# Altium schematic sheet MB1-Hed-r1.0.SchDoc: Headers
size A; DrawnBy: MBoard Team; DocumentNumber: 5; Revision: 1.1; SheetNumber: 5; SheetTotal: 7
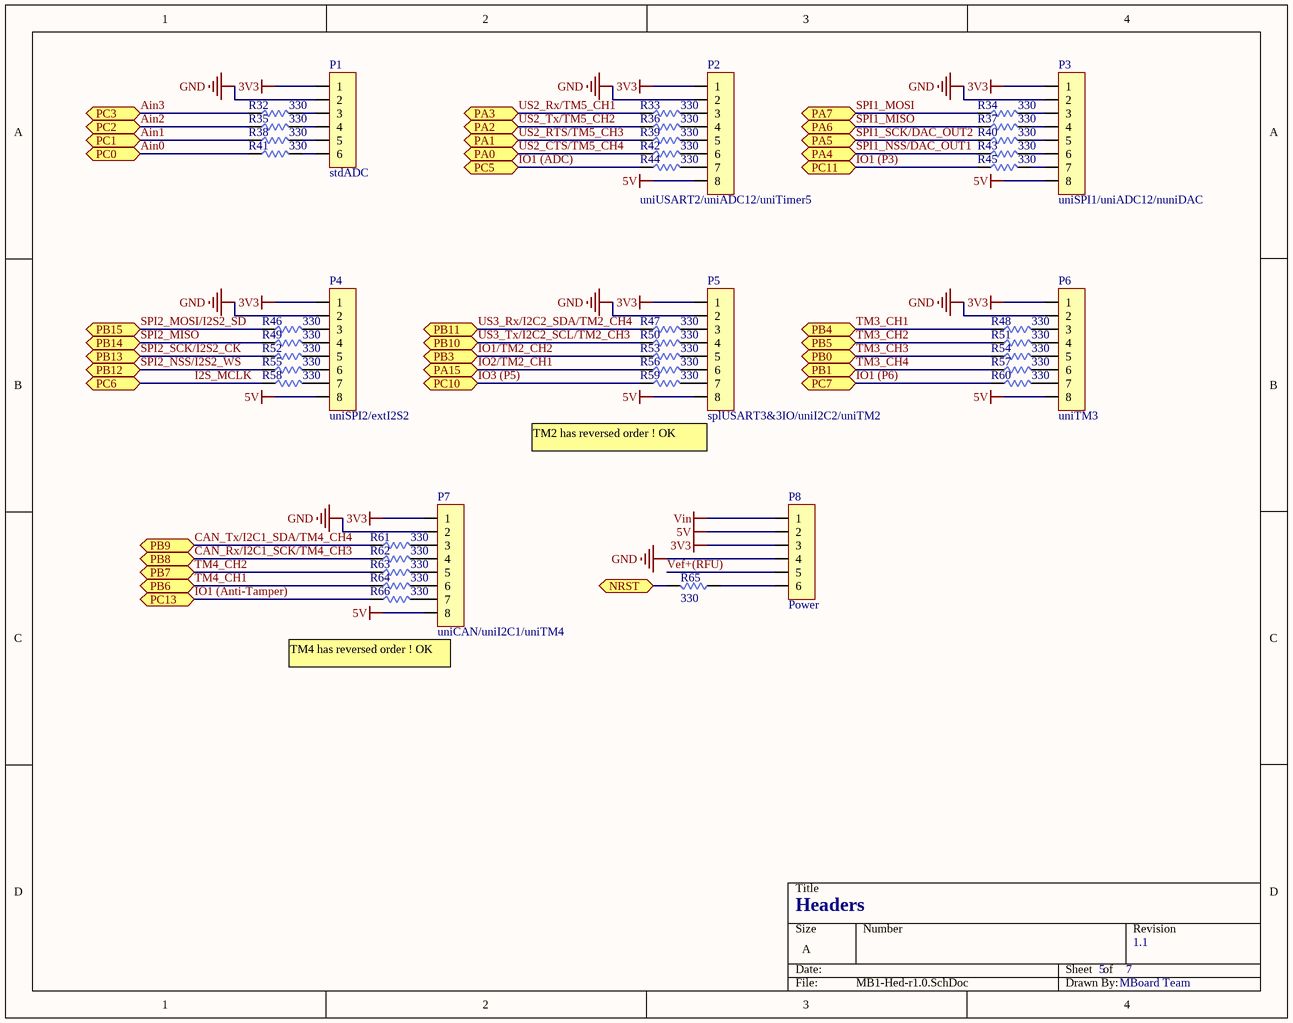
[diagram p0: MB1-Hed-r1.0.SchDoc]

## Parts
P1  stdADC  [Hed6]
P2  uniUSART2/uniADC12/uniTimer5  [Hed8]
P3  uniSPI1/uniADC12/nuniDAC  [Hed8]
P4  uniSPI2/extI2S2  [Hed8]
P5  splUSART3&3IO/uniI2C2/uniTM2  [Hed8]
P6  uniTM3  [Hed8]
P7  uniCAN/uniI2C1/uniTM4  [Hed8]
P8  Power  [Hed6]
R32  value 330  [SM_0805_R]  (hidden comment: R)
R33  value 330  [SM_0805_R]  (hidden comment: R)
R34  value 330  [SM_0805_R]  (hidden comment: R)
R35  value 330  [SM_0805_R]  (hidden comment: R)
R36  value 330  [SM_0805_R]  (hidden comment: R)
R37  value 330  [SM_0805_R]  (hidden comment: R)
R38  value 330  [SM_0805_R]  (hidden comment: R)
R39  value 330  [SM_0805_R]  (hidden comment: R)
R40  value 330  [SM_0805_R]  (hidden comment: R)
R41  value 330  [SM_0805_R]  (hidden comment: R)
R42  value 330  [SM_0805_R]  (hidden comment: R)
R43  value 330  [SM_0805_R]  (hidden comment: R)
R44  value 330  [SM_0805_R]  (hidden comment: R)
R45  value 330  [SM_0805_R]  (hidden comment: R)
R46  value 330  [SM_0805_R]  (hidden comment: R)
R47  value 330  [SM_0805_R]  (hidden comment: R)
R48  value 330  [SM_0805_R]  (hidden comment: R)
R49  value 330  [SM_0805_R]  (hidden comment: R)
R50  value 330  [SM_0805_R]  (hidden comment: R)
R51  value 330  [SM_0805_R]  (hidden comment: R)
R52  value 330  [SM_0805_R]  (hidden comment: R)
R53  value 330  [SM_0805_R]  (hidden comment: R)
R54  value 330  [SM_0805_R]  (hidden comment: R)
R55  value 330  [SM_0805_R]  (hidden comment: R)
R56  value 330  [SM_0805_R]  (hidden comment: R)
R57  value 330  [SM_0805_R]  (hidden comment: R)
R58  value 330  [SM_0805_R]  (hidden comment: R)
R59  value 330  [SM_0805_R]  (hidden comment: R)
R60  value 330  [SM_0805_R]  (hidden comment: R)
R61  value 330  [SM_0805_R]  (hidden comment: R)
R62  value 330  [SM_0805_R]  (hidden comment: R)
R63  value 330  [SM_0805_R]  (hidden comment: R)
R64  value 330  [SM_0805_R]  (hidden comment: R)
R65  value 330  [SM_0805_R]  (hidden comment: R)
R66  value 330  [SM_0805_R]  (hidden comment: R)

## Ports
NRST (bidir), PA0 (bidir), PA1 (bidir), PA2 (bidir), PA3 (bidir), PA4 (bidir), PA5 (bidir), PA6 (bidir), PA7 (bidir), PA15 (bidir), PB0 (bidir), PB1 (bidir), PB3 (bidir), PB4 (bidir), PB5 (bidir), PB6 (bidir), PB7 (bidir), PB8 (bidir), PB9 (bidir), PB10 (bidir), PB11 (bidir), PB12 (bidir), PB13 (bidir), PB14 (bidir), PB15 (bidir), PC0 (bidir), PC1 (bidir), PC2 (bidir), PC3 (bidir), PC5 (bidir), PC6 (bidir), PC7 (bidir), PC10 (bidir), PC11 (bidir), PC13 (bidir)

## Nets
3V3: P1.1 P2.1 P3.1 P4.1 P5.1 P6.1 P7.1 P8.3
5V: P2.8 P3.8 P4.8 P5.8 P6.8 P7.8 P8.2
GND: P1.2 P2.2 P3.2 P4.2 P5.2 P6.2 P7.2 P8.4
Vin: P8.1
Ain0: R41.1 ; port PC0
Ain1: R38.1 ; port PC1
Ain2: R35.1 ; port PC2
Ain3: R32.1 ; port PC3
CAN_Rx/I2C1_SCK/TM4_CH3: R62.1 ; port PB8
CAN_Tx/I2C1_SDA/TM4_CH4: R61.1 ; port PB9
I2S_MCLK: R58.1 ; port PC6
IO1 (ADC): R44.1 ; port PC5
IO1 (Anti-Tamper): R66.1 ; port PC13
IO1 (P3): R45.1 ; port PC11
IO1 (P6): R60.1 ; port PC7
IO1/TM2_CH2: R53.1 ; port PB3
IO2/TM2_CH1: R56.1 ; port PA15
IO3 (P5): R59.1 ; port PC10
NRST: R65.1 ; port NRST
SPI1_MISO: R37.1 ; port PA6
SPI1_MOSI: R34.1 ; port PA7
SPI1_NSS/DAC_OUT1: R43.1 ; port PA4
SPI1_SCK/DAC_OUT2: R40.1 ; port PA5
SPI2_MISO: R49.1 ; port PB14
SPI2_MOSI/I2S2_SD: R46.1 ; port PB15
SPI2_NSS/I2S2_WS: R55.1 ; port PB12
SPI2_SCK/I2S2_CK: R52.1 ; port PB13
TM3_CH1: R48.1 ; port PB4
TM3_CH2: R51.1 ; port PB5
TM3_CH3: R54.1 ; port PB0
TM3_CH4: R57.1 ; port PB1
TM4_CH1: R64.1 ; port PB6
TM4_CH2: R63.1 ; port PB7
US2_CTS/TM5_CH4: R42.1 ; port PA0
US2_RTS/TM5_CH3: R39.1 ; port PA1
US2_Rx/TM5_CH1: R33.1 ; port PA3
US2_Tx/TM5_CH2: R36.1 ; port PA2
US3_Rx/I2C2_SDA/TM2_CH4: R47.1 ; port PB11
US3_Tx/I2C2_SCL/TM2_CH3: R50.1 ; port PB10
Vef+(RFU): P8.5
NetP1_3: P1.3 R32.2
NetP1_4: P1.4 R35.2
NetP1_5: P1.5 R38.2
NetP1_6: P1.6 R41.2
NetP2_3: P2.3 R33.2
NetP2_4: P2.4 R36.2
NetP2_5: P2.5 R39.2
NetP2_6: P2.6 R42.2
NetP2_7: P2.7 R44.2
NetP3_3: P3.3 R34.2
NetP3_4: P3.4 R37.2
NetP3_5: P3.5 R40.2
NetP3_6: P3.6 R43.2
NetP3_7: P3.7 R45.2
NetP4_3: P4.3 R46.2
NetP4_4: P4.4 R49.2
NetP4_5: P4.5 R52.2
NetP4_6: P4.6 R55.2
NetP4_7: P4.7 R58.2
NetP5_3: P5.3 R47.2
NetP5_4: P5.4 R50.2
NetP5_5: P5.5 R53.2
NetP5_6: P5.6 R56.2
NetP5_7: P5.7 R59.2
NetP6_3: P6.3 R48.2
NetP6_4: P6.4 R51.2
NetP6_5: P6.5 R54.2
NetP6_6: P6.6 R57.2
NetP6_7: P6.7 R60.2
NetP7_3: P7.3 R61.2
NetP7_4: P7.4 R62.2
NetP7_5: P7.5 R63.2
NetP7_6: P7.6 R64.2
NetP7_7: P7.7 R66.2
NetP8_6: P8.6 R65.2

## Notes on the sheet
- TM2 has reversed order ! OK
- TM4 has reversed order ! OK

## Library data of the parts
P1 P8 = Hed6
P2-P7 = Hed8
R32-R66 = R: Resistor; Published: 8-Jun-2000; LatestRevisionDate: 29-May-2009; LatestRevisionNote: IPC-7351 Footprint Added.; PackageReference: J1-0603; Publisher: Altium Limited; PackageDescription: Chip Resistor